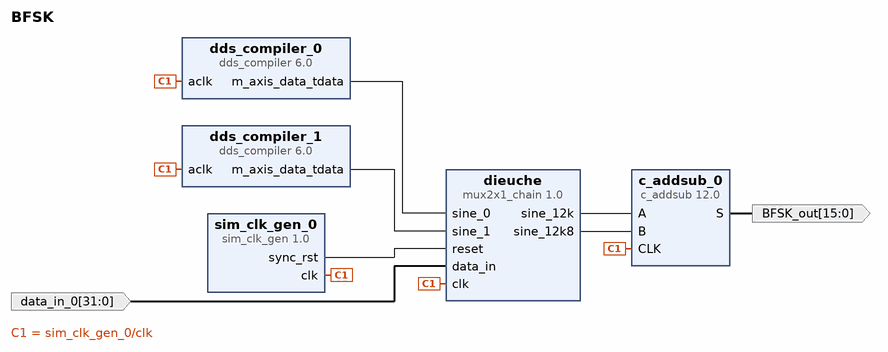
[diagram p0: block diagram of the top level]
# Vivado block design BFSK, xc7a200tsbg484-1, Vivado 2024.2
create_bd_design BFSK

create_bd_port -dir I -from 31 -to 0 data_in_0
create_bd_port -dir O -from 15 -to 0 -type data BFSK_out

create_bd_cell -type ip -vlnv xilinx.com:ip:dds_compiler:6.0 dds_compiler_0
set_property -dict [list \
  CONFIG.Frequency_Resolution 1525 \
  CONFIG.Latency 8 \
  CONFIG.Noise_Shaping Auto \
  CONFIG.OUTPUT_FORM Twos_Complement \
  CONFIG.Output_Selection Sine \
  CONFIG.Output_Width 16 \
  CONFIG.PINC1 11010 \
  CONFIG.Phase_Width 17 \
  CONFIG.Spurious_Free_Dynamic_Range 96 \
] [get_bd_cells dds_compiler_0]
create_bd_cell -type ip -vlnv xilinx.com:ip:dds_compiler:6.0 dds_compiler_1
set_property -dict [list \
  CONFIG.Frequency_Resolution 1525 \
  CONFIG.Latency 8 \
  CONFIG.Noise_Shaping Auto \
  CONFIG.OUTPUT_FORM Twos_Complement \
  CONFIG.Output_Frequency1 0.01 \
  CONFIG.Output_Selection Cosine \
  CONFIG.Output_Width 16 \
  CONFIG.PINC1 1101 \
  CONFIG.Phase_Width 17 \
  CONFIG.Spurious_Free_Dynamic_Range 96 \
] [get_bd_cells dds_compiler_1]
create_bd_cell -type ip -vlnv xilinx.com:ip:sim_clk_gen:1.0 sim_clk_gen_0
create_bd_cell -type ip -vlnv xilinx.com:user:mux2x1_chain:1.0 dieuche
create_bd_cell -type ip -vlnv xilinx.com:ip:c_addsub:12.0 c_addsub_0
set_property -dict [list \
  CONFIG.A_Width 16 \
  CONFIG.B_Value 0000000000000000 \
  CONFIG.B_Width 16 \
  CONFIG.CE false \
  CONFIG.Latency 1 \
  CONFIG.Out_Width 16 \
] [get_bd_cells c_addsub_0]

# ---- connections ----

connect_bd_net [get_bd_pins c_addsub_0/S] [get_bd_ports BFSK_out]
connect_bd_net -net data_in_0_1 [get_bd_ports data_in_0] [get_bd_pins dieuche/data_in]
connect_bd_net [get_bd_pins dds_compiler_0/m_axis_data_tdata] [get_bd_pins dieuche/sine_0]
connect_bd_net [get_bd_pins dds_compiler_1/m_axis_data_tdata] [get_bd_pins dieuche/sine_1]
connect_bd_net -net mux2x1_chain_0_sine_12k [get_bd_pins dieuche/sine_12k] [get_bd_pins c_addsub_0/A]
connect_bd_net -net mux2x1_chain_0_sine_12k8 [get_bd_pins dieuche/sine_12k8] [get_bd_pins c_addsub_0/B]
connect_bd_net [get_bd_pins sim_clk_gen_0/clk] \
  [get_bd_pins dds_compiler_0/aclk] [get_bd_pins dds_compiler_1/aclk] [get_bd_pins dieuche/clk] [get_bd_pins c_addsub_0/CLK]
connect_bd_net [get_bd_pins sim_clk_gen_0/sync_rst] [get_bd_pins dieuche/reset]

validate_bd_design
save_bd_design
